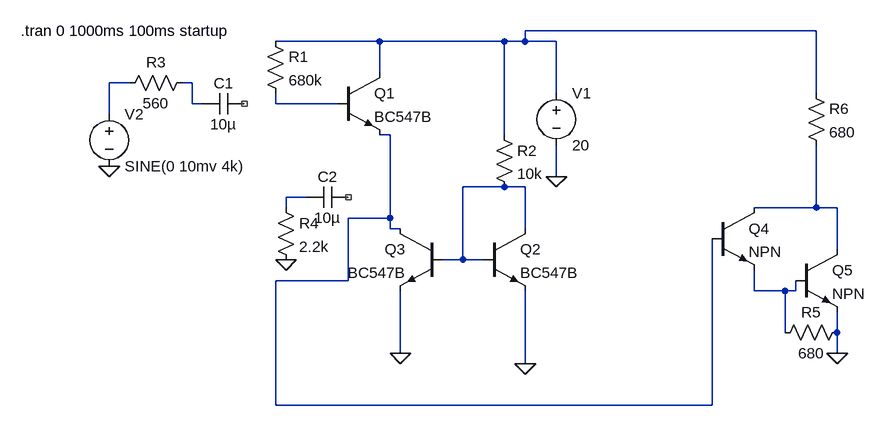
[diagram p0: schematic opcion 3.asc]
opcion 3.asc, the LTspice schematic file:
Version 4
SHEET 1 908 680
WIRE 832 -16 384 -16
WIRE 160 0 0 0
WIRE 352 0 160 0
WIRE 384 0 384 -16
WIRE 384 0 352 0
WIRE 432 0 384 0
WIRE 160 48 160 0
WIRE -224 64 -256 64
WIRE -128 64 -144 64
WIRE 432 80 432 0
WIRE 832 80 832 -16
WIRE -128 96 -128 64
WIRE -112 96 -128 96
WIRE 0 96 0 80
WIRE 96 96 0 96
WIRE -256 112 -256 64
WIRE 176 144 160 144
WIRE 352 144 352 0
WIRE 432 208 432 160
WIRE 352 224 288 224
WIRE 384 224 352 224
WIRE 48 240 16 240
WIRE 16 256 16 240
WIRE 832 256 832 160
WIRE 832 256 736 256
WIRE 864 256 832 256
WIRE 176 272 176 144
WIRE 176 272 112 272
WIRE 176 288 176 272
WIRE 192 288 176 288
WIRE 384 288 384 224
WIRE 864 320 864 256
WIRE 288 336 288 224
WIRE 288 336 256 336
WIRE 320 336 288 336
WIRE 112 368 112 272
WIRE 112 368 0 368
WIRE 736 384 736 352
WIRE 784 384 736 384
WIRE 800 384 800 368
WIRE 800 384 784 384
WIRE 784 448 784 384
WIRE 864 448 864 416
WIRE 192 480 192 384
WIRE 864 480 864 448
WIRE 384 496 384 384
WIRE 0 560 0 368
WIRE 672 560 672 304
WIRE 672 560 0 560
FLAG 432 208 0
FLAG -256 192 0
FLAG 16 336 0
FLAG 384 496 0
FLAG 192 480 0
FLAG 864 480 0
SYMBOL npn 96 48 R0
SYMATTR InstName Q1
SYMATTR Value BC547B
SYMBOL res -16 -16 R0
SYMATTR InstName R1
SYMATTR Value 680k
SYMBOL voltage 432 64 R0
WINDOW 123 0 0 Left 2
WINDOW 39 0 0 Left 2
SYMATTR InstName V1
SYMATTR Value 20
SYMBOL cap -48 80 R90
WINDOW 0 0 32 VBottom 2
WINDOW 3 32 32 VTop 2
SYMATTR InstName C1
SYMATTR Value 10µ
SYMBOL res -128 48 R90
WINDOW 0 0 56 VBottom 2
WINDOW 3 32 56 VTop 2
SYMATTR InstName R3
SYMATTR Value 560
SYMBOL res 0 240 R0
SYMATTR InstName R4
SYMATTR Value 2.2k
SYMBOL npn 320 288 R0
SYMATTR InstName Q2
SYMATTR Value BC547B
SYMBOL npn 256 288 M0
SYMATTR InstName Q3
SYMATTR Value BC547B
SYMBOL cap 112 224 R90
WINDOW 0 0 32 VBottom 2
WINDOW 3 32 32 VTop 2
SYMATTR InstName C2
SYMATTR Value 10µ
SYMBOL voltage -256 96 R0
WINDOW 123 0 0 Left 2
WINDOW 39 0 0 Left 2
SYMATTR InstName V2
SYMATTR Value SINE(0 10mv 4k)
SYMBOL res 336 128 R0
SYMATTR InstName R2
SYMATTR Value 10k
SYMBOL npn 672 256 R0
SYMATTR InstName Q4
SYMBOL npn 800 320 R0
SYMATTR InstName Q5
SYMBOL res 880 432 R90
WINDOW 0 0 56 VBottom 2
WINDOW 3 32 56 VTop 2
SYMATTR InstName R5
SYMATTR Value 680
SYMBOL res 816 64 R0
SYMATTR InstName R6
SYMATTR Value 680
TEXT -392 -16 Left 2 !.tran 0 1000ms 100ms startup

The netlist it stands for:
* opcion 3.asc
Q1 N001 N004 N005 0 BC547B
R1 N001 N004 680k
V1 N001 0 20
C1 NC_01 N003 10µ
R3 N003 N002 560
R4 N007 0 2.2k
Q2 N006 N006 0 0 BC547B
Q3 N005 N006 0 0 BC547B
C2 NC_02 N007 10µ
V2 N002 0 SINE(0 10mv 4k)
R2 N001 N006 10k
Q4 N008 N005 N009 0 NPN
Q5 N008 N009 0 0 NPN
R5 0 N009 680
R6 N001 N008 680
.model NPN NPN
.model PNP PNP
.lib standard.bjt
.tran 0 1000ms 100ms startup
.backanno
.end